# Altium schematic sheet BootDriver.SchDoc
size A4; SheetNumber: 20; SheetTotal: 21
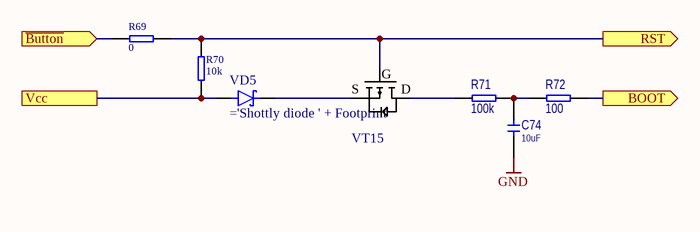
[diagram p0: BootDriver.SchDoc]

## Parts
C74  value 10uF  [CERCAP 0603]
R69  value 0  [RES 0402]
R70  value 10k  [RES 0402]
R71  value 100k  [RES 0402]
R72  value 100  [RES 0402]
VD5  (no value)  [SOD-123]
VT15  AO3407A  [SOT23-3]  (value not drawn)

## Ports
BOOT (out), RST (out), Vcc, ~{Button} (in)

## Nets
GND: C74.1
~{Button}: R69.1 ; port ~{Button}
BOOT: R72.2 ; port BOOT
RST: R69.2 R70.2 VT15.G2 ; port RST
Vcc: R70.1 VD5.A(Anode) ; port Vcc
NetC74_2: C74.2 R71.2 R72.1
NetR71_1: R71.1 VT15.D1
NetVD5_C: VD5.C(Cathode) VT15.S1

## Notes on the sheet
- (in symbol !Generic P MOSFET) G; S; D

## Library data of the parts
C74 = !Capacitor: Capacitor; IsSMT: NoSMT; Voltage: 50V; Diel: X7R
R69-R72 = !Resistor: Resistor; IsSMT: NoSMT
VD5 = DiodeS: Diode Shottky; IsSMT: NoSMT
VT15 = !Generic P MOSFET: generic P mosfet; pin to pad: D1>3 G2>1 S1>2; IsSMT: NoSMT